# EAGLE board C1316G (EAGLE 6.6.0)
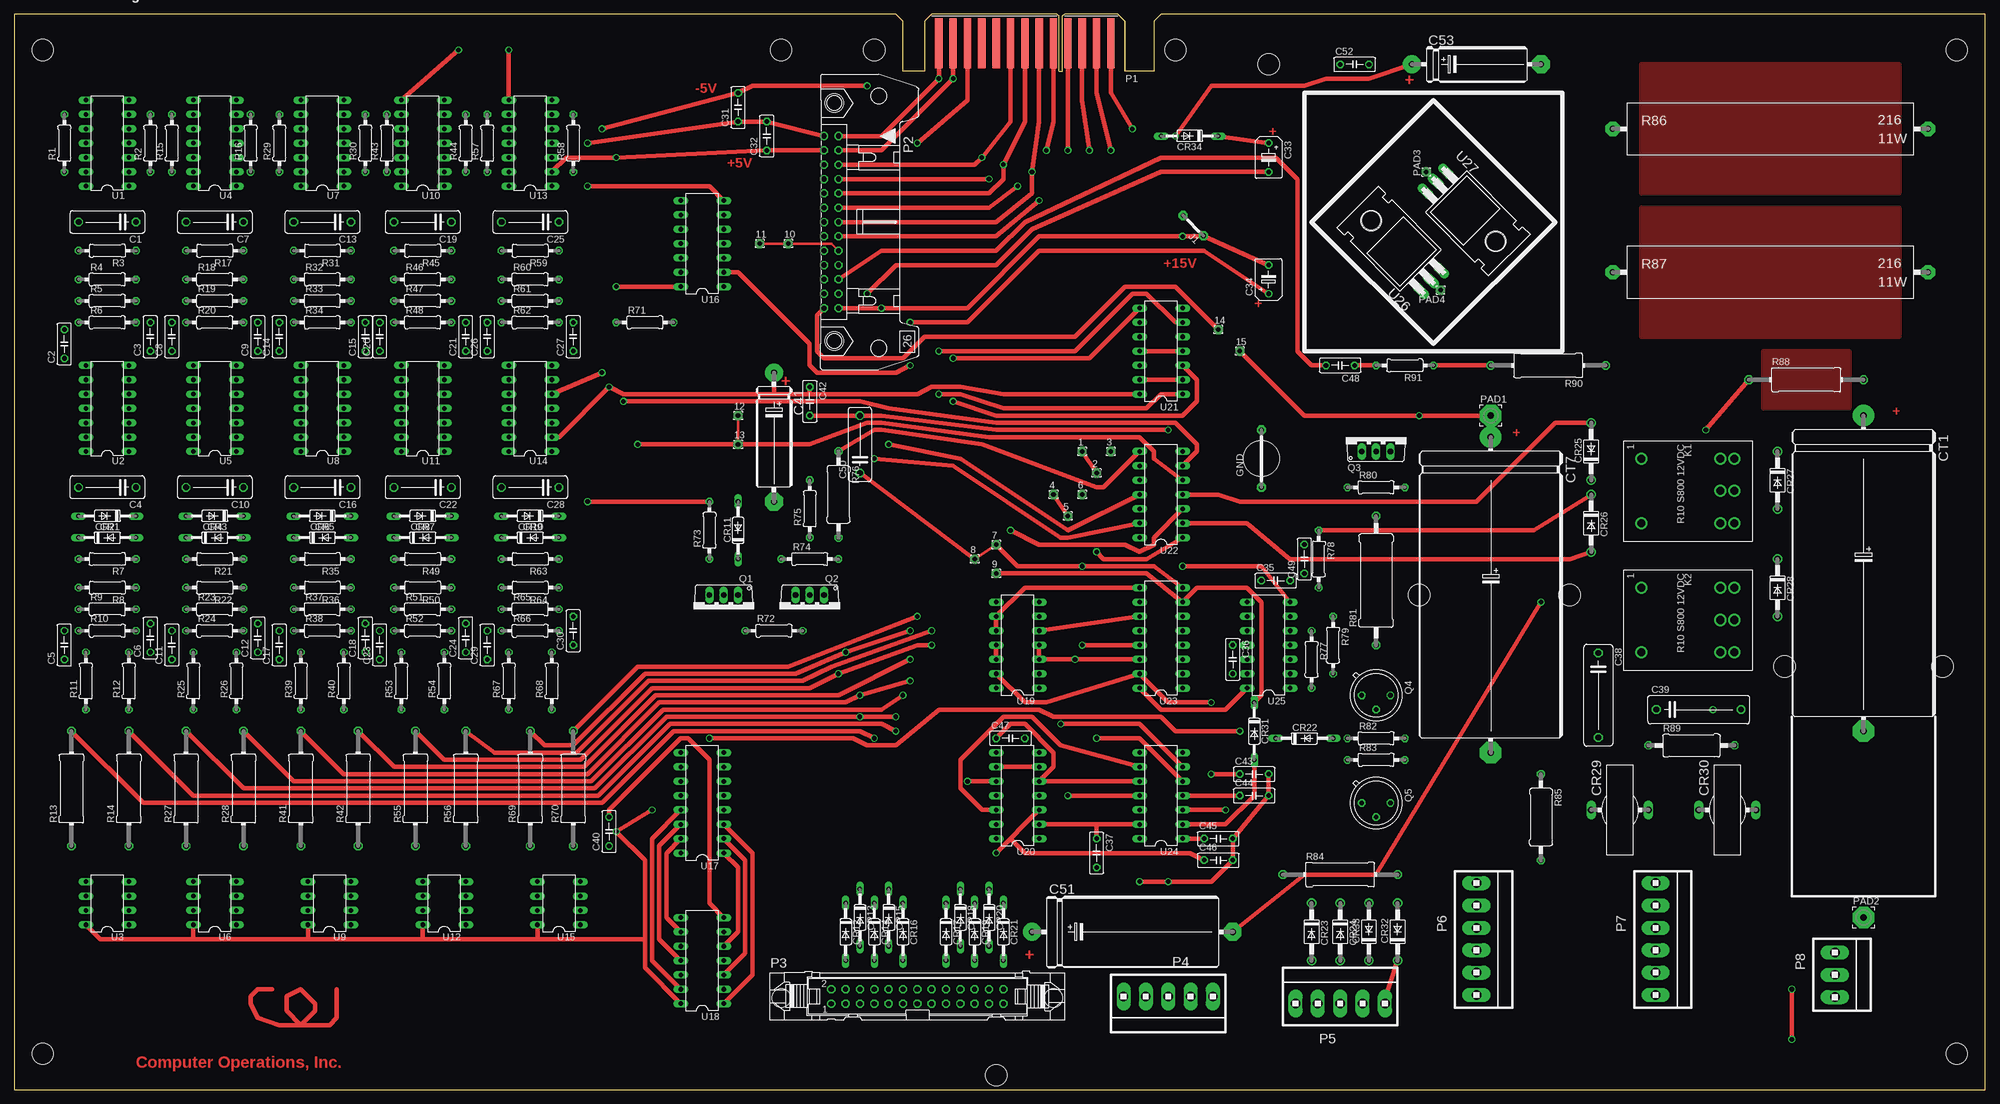
[diagram p2: board, top side]
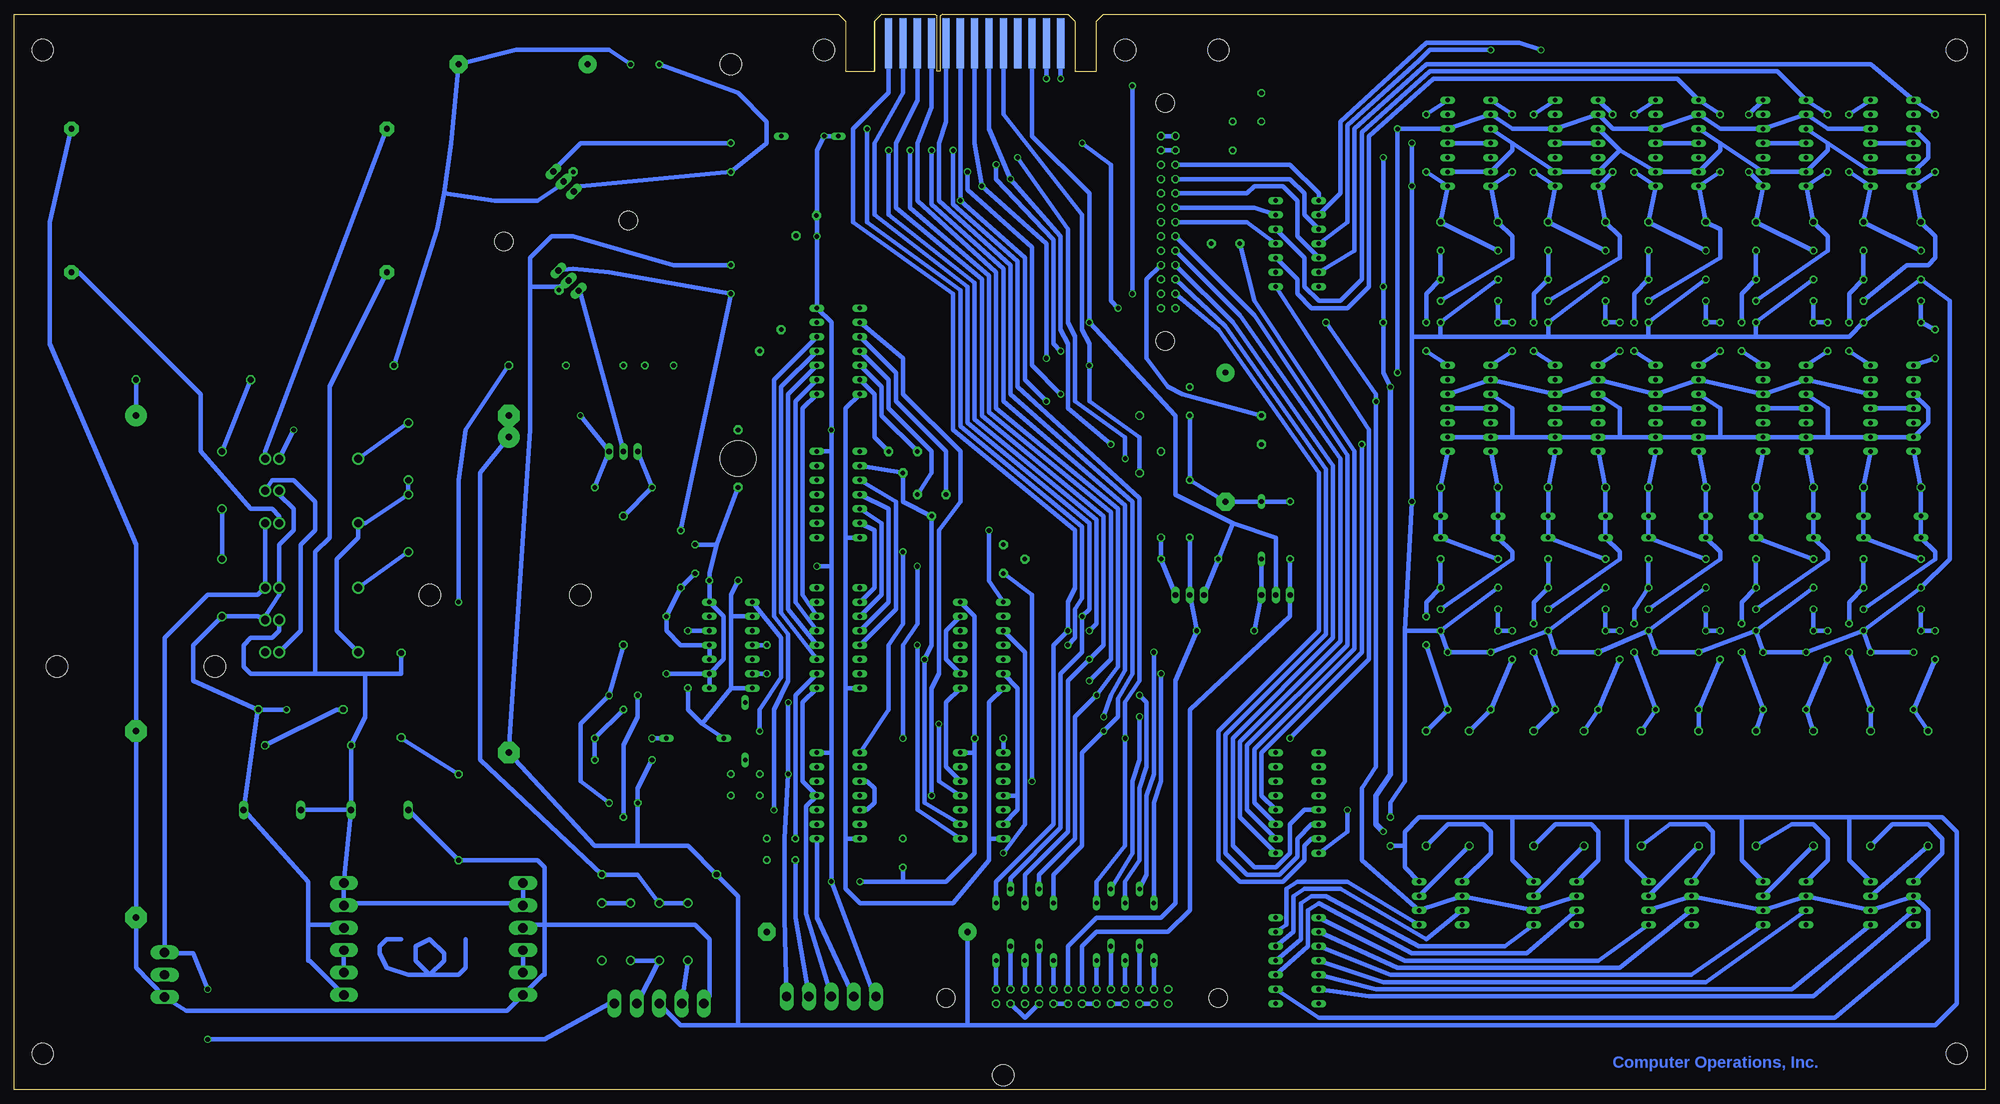
[diagram p3: board, bottom side, seen from below]

Size 349.25 x 190.5 mm. Coordinates in mm from the lower left corner, seen from the top.
Outline: 195.58,190.5 196.85,189.23 196.85,180.34 201.93,180.34 201.93,189.23 203.2,190.5 349.25,190.5 349.25,0 0,0 0,190.5 156.21,190.5 157.48,189.23 157.48,180.34 161.29,180.34 161.29,189.23 162.56,190.5
Copper layers (1+16): Top 0.035mm / dielectric 1.5mm / Bottom 0.035mm
Design rules "16mils": minimum track width 16mil, minimum drill 32mil, track to track 15mil, track to pad 10mil, pad to pad 10mil, via to via 10mil, smd to smd 10mil, copper to edge 9mil, drill to drill 10mil, minimum pad ring 10mil, minimum via ring 8mil, stop-mask expansion 0mil, vias tented up to drill 0mil, thermal gap 10mil
Holes 3.81 mm at 5.08,184.15 5.08,6.35 344.17,6.35 344.17,184.15 135.89,184.15 173.99,2.54 152.4,184.15 205.74,184.15 222.25,181.61 248.92,87.63 275.59,87.63 313.69,74.93 341.63,74.93
Holes 6.35 mm at 220.98,111.76

## Footprints (pad centres in the part's own frame; a part is rotated, then mirrored left to right if it is on the bottom)
1,6/0,8 = drill 0.813 pad 1.6 octagon: 1 0,0
C102-043X133 = drill 1.016 octagon: 1 -5.08,0; 2 5.08,0
C050-025X075 = drill 0.813 octagon: 1 -2.54,0; 2 2.54,0
B45181B = drill 0.813: + -2.54,0 | drill 0.813 octagon: - 2.54,0
C150-054X183 = drill 1.016 octagon: 1 -7.493,0; 2 7.493,0
E22-6 = drill 1.016 pad 3.15: + -11.43,0 | drill 1.016 pad 3.15 octagon: - 11.43,0
E35-12 = drill 1.118 pad 3.15: + -17.78,0 | drill 1.118 pad 3.15 octagon: - 17.78,0
DO35-10 = drill 0.813 long: A 5.08,0; C -5.08,0
DO41-10 = drill 1.118: A 5.08,0; C -5.08,0
N644B = drill 1.118 long: 1 -5.08,0; 2 5.08,0
E55-25 = drill 1.118 pad 3.81: + -27.94,0 | drill 1.118 pad 3.81 octagon: - 27.94,0
10 = drill 0.813 pad 1.6 octagon: 1 -5.08,0; 2 5.08,0
05 = drill 0.813 pad 1.6 octagon: 1 -2.54,0; 2 2.54,0
R10 = drill 1.422: 1 -5.08,-6.35; 4 6.35,-6.35; 5 -5.08,7.62; 6 0.635,10.16; 7 -5.08,10.16; 8 6.35,7.62; 9 0.635,7.62; 10 6.35,10.16
EDGE13X2 = smd 1.27 x 8.89: A1 -15.24,3.873; A2 -12.7,3.873; A3 -10.16,3.873; A4 -7.62,3.873; A5 -5.08,3.873; A6 -2.54,3.873; A7 0,3.873; A8 2.54,3.873; A9 5.08,3.873; A10 7.62,3.873; A11 10.16,3.873; A12 12.7,3.873; A13 15.24,3.873 | smd 1.27 x 8.89 bottom: B1 -15.24,3.873; B2 -12.7,3.873; B3 -10.16,3.873; B4 -7.62,3.873; B5 -5.08,3.873; B6 -2.54,3.873; B7 0,3.873; B8 2.54,3.873; B9 5.08,3.873; B10 7.62,3.873; B11 10.16,3.873; B12 12.7,3.873; B13 15.24,3.873
26H = drill 0.914: 1 -15.24,-1.27 | drill 0.914 octagon: 2 -15.24,1.27; 3 -12.7,-1.27; 4 -12.7,1.27; 5 -10.16,-1.27; 6 -10.16,1.27; 7 -7.62,-1.27; 8 -7.62,1.27; 9 -5.08,-1.27; 10 -5.08,1.27; 11 -2.54,-1.27; 12 -2.54,1.27; 13 0,-1.27; 14 0,1.27; 15 2.54,-1.27; 16 2.54,1.27; 17 5.08,-1.27; 18 5.08,1.27; 19 7.62,-1.27; 20 7.62,1.27; 21 10.16,-1.27; 22 10.16,1.27; 23 12.7,-1.27; 24 12.7,1.27; 25 15.24,-1.27; 26 15.24,1.27 | hole 3.302: -21.082,0.533; 21.082,0.533
26V = drill 0.914: 1 -15.24,-1.27 | drill 0.914 octagon: 2 -15.24,1.27; 3 -12.7,-1.27; 4 -12.7,1.27; 5 -10.16,-1.27; 6 -10.16,1.27; 7 -7.62,-1.27; 8 -7.62,1.27; 9 -5.08,-1.27; 10 -5.08,1.27; 11 -2.54,-1.27; 12 -2.54,1.27; 13 0,-1.27; 14 0,1.27; 15 2.54,-1.27; 16 2.54,1.27; 17 5.08,-1.27; 18 5.08,1.27; 19 7.62,-1.27; 20 7.62,1.27; 21 10.16,-1.27; 22 10.16,1.27; 23 12.7,-1.27; 24 12.7,1.27; 25 15.24,-1.27; 26 15.24,1.27 | hole 3.302: 24.13,-0.254; -24.13,-0.254
1X5MTA = drill 1.676 long: 1 7.925,0; 2 3.962,0; 3 0,0; 4 -3.962,0; 5 -7.925,0
1X6MTA = drill 1.676 long: 1 9.906,0; 2 5.944,0; 3 1.981,0; 4 -1.981,0; 5 -5.944,0; 6 -9.906,0
1X3MTA = drill 1.676 long: 1 3.937,0; 2 -0.025,0; 3 -3.988,0
3,81/1,1 = drill 1.118 pad 3.81 octagon: 1 0,0
TO220AV = drill 1.016 long: B -2.54,-2.54; C 0,-2.54; E 2.54,-2.54
TO5 = drill 0.813 octagon: 1 0,-2.54; 2 2.54,0; 3 0,2.54
0207/10 = drill 0.813 octagon: 1 -5.08,0; 2 5.08,0
0414/20 = drill 1.016 octagon: 1 -10.16,0; 2 10.16,0
0411/15 = drill 0.914 octagon: 1 -7.62,0; 2 7.62,0
0617/22 = drill 1.016 octagon: 1 -11.43,0; 2 11.43,0
KH216-8 = drill 1.016 pad 2.54 octagon: 1 -27.94,0; 2 27.94,0
DIL14 = drill 0.813 long: 1 -7.62,-3.81; 2 -5.08,-3.81; 3 -2.54,-3.81; 4 0,-3.81; 5 2.54,-3.81; 6 5.08,-3.81; 7 7.62,-3.81; 8 7.62,3.81; 9 5.08,3.81; 10 2.54,3.81; 11 0,3.81; 12 -2.54,3.81; 13 -5.08,3.81; 14 -7.62,3.81
DIL08 = drill 0.813 long: 1 -3.81,-3.81; 2 -1.27,-3.81; 3 1.27,-3.81; 4 3.81,-3.81; 5 3.81,3.81; 6 1.27,3.81; 7 -1.27,3.81; 8 -3.81,3.81
DIL16 = drill 0.813 long: 1 -8.89,-3.81; 2 -6.35,-3.81; 3 -3.81,-3.81; 4 -1.27,-3.81; 5 1.27,-3.81; 6 3.81,-3.81; 7 6.35,-3.81; 8 8.89,-3.81; 9 8.89,3.81; 10 6.35,3.81; 11 3.81,3.81; 12 1.27,3.81; 13 -1.27,3.81; 14 -3.81,3.81; 15 -6.35,3.81; 16 -8.89,3.81
TO220H = drill 1.118 long: 1 -2.54,-10.16; 2 0,-10.16; 3 2.54,-10.16 | hole 3.302: 0,4.826

## Placement (x,y rotation side)
1  [1,6/0,8]  189.23,113.03 0 top
2  [1,6/0,8]  191.77,109.22 0 top
3  [1,6/0,8]  194.31,113.03 0 top
4  [1,6/0,8]  184.15,105.41 0 top
5  [1,6/0,8]  186.69,101.6 0 top
6  [1,6/0,8]  189.23,105.41 0 top
7  [1,6/0,8]  173.99,96.52 0 top
8  [1,6/0,8]  170.18,93.98 0 top
9  [1,6/0,8]  173.99,91.44 0 top
10  [1,6/0,8]  137.16,149.86 0 top
11  [1,6/0,8]  132.08,149.86 0 top
12  [1,6/0,8]  128.27,119.38 0 top
13  [1,6/0,8]  128.27,114.3 0 top
14  [1,6/0,8]  213.36,134.62 0 top
15  [1,6/0,8]  217.17,130.81 0 top
C1  [C102-043X133]  16.51,153.67 180 top
C2  [C050-025X075]  8.89,132.08 90 top
C3  [C050-025X075]  24.13,133.35 90 top
C4  [C102-043X133]  16.51,106.68 180 top
C5  [C050-025X075]  8.89,78.74 90 top
C6  [C050-025X075]  24.13,80.01 90 top
C7  [C102-043X133]  35.56,153.67 180 top
C8  [C050-025X075]  27.94,133.35 90 top
C9  [C050-025X075]  43.18,133.35 90 top
C10  [C102-043X133]  35.56,106.68 180 top
C11  [C050-025X075]  27.94,78.74 90 top
C12  [C050-025X075]  43.18,80.01 90 top
C13  [C102-043X133]  54.61,153.67 180 top
C14  [C050-025X075]  46.99,133.35 90 top
C15  [C050-025X075]  62.23,133.35 90 top
C16  [C102-043X133]  54.61,106.68 180 top
C17  [C050-025X075]  46.99,78.74 90 top
C18  [C050-025X075]  62.23,80.01 90 top
C19  [C102-043X133]  72.39,153.67 180 top
C20  [C050-025X075]  64.77,133.35 90 top
C21  [C050-025X075]  80.01,133.35 90 top
C22  [C102-043X133]  72.39,106.68 180 top
C23  [C050-025X075]  64.77,78.74 90 top
C24  [C050-025X075]  80.01,80.01 90 top
C25  [C102-043X133]  91.44,153.67 180 top
C26  [C050-025X075]  83.82,133.35 90 top
C27  [C050-025X075]  99.06,133.35 90 top
C28  [C102-043X133]  91.44,106.68 180 top
C29  [C050-025X075]  83.82,78.74 90 top
C30  [C050-025X075]  99.06,81.28 90 top
C31  [C050-025X075]  128.27,173.99 90 top
C32  [C050-025X075]  133.35,168.91 90 top
C33  [B45181B]  222.25,165.1 270 top
C34  [B45181B]  222.25,143.51 90 top
C35  [C050-025X075]  223.52,90.17 0 top
C36  [C050-025X075]  215.9,76.2 270 top
C37  [C050-025X075]  191.77,41.91 270 top
C38  [C150-054X183]  280.67,69.85 270 top
C39  [C150-054X183]  298.45,67.31 0 top
C40  [C050-025X075]  105.41,45.72 90 top
C41  [E22-6]  134.62,115.57 270 top
C42  [C050-025X075]  140.97,121.92 270 top
C43  470pF  [C050-025X075]  219.71,55.88 0 top
C44  470pF  [C050-025X075]  219.71,52.07 0 top
C45  470pF  [C050-025X075]  213.36,44.45 0 top
C46  470pF  [C050-025X075]  213.36,40.64 0 top
C47  [C050-025X075]  176.53,62.23 0 top
C48  [C050-025X075]  234.95,128.27 180 top
C49  [C050-025X075]  228.6,93.98 90 top
C50  [C102-043X133]  149.86,114.3 90 top
C51  250uF 50V  [E35-12]  198.12,27.94 0 top
C52  [C050-025X075]  237.49,181.61 0 top
C53  [E22-6]  259.08,181.61 0 top
CR1  1N4148  [DO35-10]  16.51,101.6 180 top
CR2  1N4148  [DO35-10]  16.51,97.79 0 top
CR3  1N4148  [DO35-10]  35.56,101.6 180 top
CR4  1N4148  [DO35-10]  35.56,97.79 0 top
CR5  1N4148  [DO35-10]  54.61,101.6 180 top
CR6  1N4148  [DO35-10]  54.61,97.79 0 top
CR7  1N4148  [DO35-10]  72.39,101.6 180 top
CR8  1N4148  [DO35-10]  72.39,97.79 0 top
CR9  1N4148  [DO35-10]  91.44,101.6 180 top
CR10  1N4148  [DO35-10]  91.44,97.79 0 top
CR11  1N4148  [DO35-10]  128.27,99.06 90 top
CR12  1N4148  [DO35-10]  147.32,27.94 270 top
CR13  1N4148  [DO35-10]  149.86,30.48 270 top
CR14  1N4148  [DO35-10]  152.4,27.94 270 top
CR15  1N4148  [DO35-10]  154.94,30.48 270 top
CR16  1N4148  [DO35-10]  157.48,27.94 270 top
CR17  1N4148  [DO35-10]  165.1,27.94 270 top
CR18  1N4148  [DO35-10]  167.64,30.48 270 top
CR19  1N4148  [DO35-10]  170.18,27.94 270 top
CR20  1N4148  [DO35-10]  172.72,30.48 270 top
CR21  1N4148  [DO35-10]  175.26,27.94 270 top
CR22  1N4148  [DO35-10]  228.6,62.23 0 top
CR23  1N4004  [DO41-10]  229.87,27.94 270 top
CR24  1N4004  [DO41-10]  234.95,27.94 270 top
CR25  1N4004  [DO41-10]  279.4,113.03 90 top
CR26  1N4004  [DO41-10]  279.4,100.33 270 top
CR27  1N4004  [DO41-10]  312.42,107.95 270 top
CR28  1N4004  [DO41-10]  312.42,88.9 270 top
CR29  7J5E5  [N644B]  284.48,49.53 0 top
CR30  7J5E5  [N644B]  303.53,49.53 0 top
CR31  1N4148  [DO35-10]  219.71,63.5 270 top
CR32  1N4004  [DO41-10]  245.11,27.94 90 top
CR33  1N4004  [DO41-10]  240.03,27.94 90 top
CR34  1N4148  [DO35-10]  208.28,168.91 180 top
CT1  225uF  [E55-25]  327.66,91.44 270 top
CT7  100uF  [E55-25]  261.62,87.63 270 top
GND  J10MM  [10]  220.98,111.76 90 top
J1  J5MM  [05]  208.91,153.03 135 top
K1  R10 S800 12VDC  [R10]  294.64,106.68 270 top
K2  R10 S800 12VDC  [R10]  294.64,83.82 270 top
P1  EDGE13X2  [EDGE13X2]  179.07,189.23 180 top
P2  [26H]  144.78,153.67 270 top
P3  [26V]  160.02,16.51 0 top
P4  [1X5MTA]  204.47,16.51 180 top
P5  [1X5MTA]  234.95,15.24 0 top
P6  [1X6MTA]  259.08,26.67 270 top
P7  [1X6MTA]  290.83,26.67 270 top
P8  [1X3MTA]  322.58,20.32 270 top
PAD1  [3,81/1,1]  261.62,119.38 0 top
PAD2  [3,81/1,1]  327.66,30.48 0 top
PAD3  [1,6/0,8]  250.19,162.56 90 top
PAD4  [1,6/0,8]  252.73,141.6 180 top
Q1  TIP31A  [TO220AV]  125.73,85.09 180 top
Q2  TIP32  [TO220AV]  140.97,85.09 180 top
Q3  TIP32  [TO220AV]  241.3,115.57 0 top
Q4  2N2222  [TO5]  241.3,69.85 270 top
Q5  2N2222  [TO5]  241.3,50.8 270 top
R1  220  [0207/10]  8.89,167.64 90 top
R2  220  [0207/10]  24.13,167.64 90 top
R3  470  [0207/10]  16.51,148.59 180 top
R4  1000  [0207/10]  16.51,143.51 0 top
R5  470  [0207/10]  16.51,139.7 0 top
R6  1000  [0207/10]  16.51,135.89 0 top
R7  1000  [0207/10]  16.51,93.98 180 top
R8  470  [0207/10]  16.51,88.9 180 top
R9  1000  [0207/10]  16.51,85.09 0 top
R10  470  [0207/10]  16.51,81.28 0 top
R11  12K  [0207/10]  12.7,72.39 90 top
R12  12K  [0207/10]  20.32,72.39 90 top
R13  100 5W  [0414/20]  10.16,53.34 90 top
R14  100 5W  [0414/20]  20.32,53.34 90 top
R15  220  [0207/10]  27.94,167.64 90 top
R16  220  [0207/10]  41.91,167.64 90 top
R17  470  [0207/10]  35.56,148.59 180 top
R18  1000  [0207/10]  35.56,143.51 0 top
R19  470  [0207/10]  35.56,139.7 0 top
R20  1000  [0207/10]  35.56,135.89 0 top
R21  1000  [0207/10]  35.56,93.98 180 top
R22  470  [0207/10]  35.56,88.9 180 top
R23  1000  [0207/10]  35.56,85.09 0 top
R24  470  [0207/10]  35.56,81.28 0 top
R25  12K  [0207/10]  31.75,72.39 90 top
R26  12K  [0207/10]  39.37,72.39 90 top
R27  100 5W  [0414/20]  30.48,53.34 90 top
R28  100 5W  [0414/20]  40.64,53.34 90 top
R29  220  [0207/10]  46.99,167.64 90 top
R30  220  [0207/10]  62.23,167.64 90 top
R31  470  [0207/10]  54.61,148.59 180 top
R32  1000  [0207/10]  54.61,143.51 0 top
R33  470  [0207/10]  54.61,139.7 0 top
R34  1000  [0207/10]  54.61,135.89 0 top
R35  1000  [0207/10]  54.61,93.98 180 top
R36  470  [0207/10]  54.61,88.9 180 top
R37  1000  [0207/10]  54.61,85.09 0 top
R38  470  [0207/10]  54.61,81.28 0 top
R39  12K  [0207/10]  50.8,72.39 90 top
R40  12K  [0207/10]  58.42,72.39 90 top
R41  100 5W  [0414/20]  50.8,53.34 90 top
R42  100 5W  [0414/20]  60.96,53.34 90 top
R43  220  [0207/10]  66.04,167.64 90 top
R44  220  [0207/10]  80.01,167.64 90 top
R45  470  [0207/10]  72.39,148.59 180 top
R46  1000  [0207/10]  72.39,143.51 0 top
R47  470  [0207/10]  72.39,139.7 0 top
R48  1000  [0207/10]  72.39,135.89 0 top
R49  1000  [0207/10]  72.39,93.98 180 top
R50  470  [0207/10]  72.39,88.9 180 top
R51  1000  [0207/10]  72.39,85.09 0 top
R52  470  [0207/10]  72.39,81.28 0 top
R53  12K  [0207/10]  68.58,72.39 90 top
R54  12K  [0207/10]  76.2,72.39 90 top
R55  100 5W  [0414/20]  71.12,53.34 90 top
R56  100 5W  [0414/20]  80.01,53.34 90 top
R57  220  [0207/10]  83.82,167.64 90 top
R58  220  [0207/10]  99.06,167.64 90 top
R59  470  [0207/10]  91.44,148.59 180 top
R60  1000  [0207/10]  91.44,143.51 0 top
R61  470  [0207/10]  91.44,139.7 0 top
R62  1000  [0207/10]  91.44,135.89 0 top
R63  1000  [0207/10]  91.44,93.98 180 top
R64  470  [0207/10]  91.44,88.9 180 top
R65  1000  [0207/10]  91.44,85.09 0 top
R66  470  [0207/10]  91.44,81.28 0 top
R67  12K  [0207/10]  87.63,72.39 90 top
R68  12K  [0207/10]  95.25,72.39 90 top
R69  100 5W  [0414/20]  91.44,53.34 90 top
R70  100 5W  [0414/20]  99.06,53.34 90 top
R71  1000  [0207/10]  111.76,135.89 0 top
R72  [0207/10]  134.62,81.28 0 top
R73  12K  [0207/10]  123.19,99.06 90 top
R74  180  [0207/10]  140.97,93.98 0 top
R75  12K  [0207/10]  140.97,102.87 90 top
R76  5K 1/2W  [0411/15]  146.05,105.41 270 top
R77  1000  [0207/10]  229.87,76.2 270 top
R78  1000  [0207/10]  231.14,93.98 270 top
R79  220  [0207/10]  233.68,78.74 270 top
R80  [0207/10]  241.3,106.68 0 top
R81  400 3W  [0617/22]  241.3,90.17 90 top
R82  100  [0207/10]  241.3,62.23 0 top
R83  5.7K  [0207/10]  241.3,58.42 0 top
R84  1.5K 3W  [0414/20]  234.95,38.1 0 top
R85  29 1W  [0411/15]  270.51,48.26 270 top
R86  120 5%  [KH216-8]  311.15,170.18 0 top
R87  120 5%  [KH216-8]  311.15,144.78 0 top
R88  180 5W  [0414/20]  317.5,125.73 0 top
R89  29 1W  [0411/15]  297.18,60.96 0 top
R90  100 5W  [0414/20]  271.78,128.27 180 top
R91  [0207/10]  246.38,128.27 180 top
U1  UA733N  [DIL14]  16.51,167.64 90 top
U2  UA733N  [DIL14]  16.51,120.65 90 top
U3  DS75452N  [DIL08]  16.51,33.02 90 top
U4  UA733N  [DIL14]  35.56,167.64 90 top
U5  UA733N  [DIL14]  35.56,120.65 90 top
U6  DS75452N  [DIL08]  35.56,33.02 90 top
U7  UA733N  [DIL14]  54.61,167.64 90 top
U8  UA733N  [DIL14]  54.61,120.65 90 top
U9  DS75452N  [DIL08]  55.88,33.02 90 top
U10  UA733N  [DIL14]  72.39,167.64 90 top
U11  UA733N  [DIL14]  72.39,120.65 90 top
U12  DS75452N  [DIL08]  76.2,33.02 90 top
U13  UA733N  [DIL14]  91.44,167.64 90 top
U14  UA733N  [DIL14]  91.44,120.65 90 top
U15  DS75452N  [DIL08]  96.52,33.02 90 top
U16  7406N  [DIL14]  121.92,149.86 90 top
U17  [DIL16]  121.92,50.8 90 top
U18  7404N  [DIL14]  121.92,22.86 90 top
U19  7410N  [DIL14]  177.8,78.74 90 top
U20  7410N  [DIL14]  177.8,52.07 90 top
U21  7406N  [DIL14]  203.2,130.81 90 top
U22  7406N  [DIL14]  203.2,105.41 90 top
U23  [DIL16]  203.2,80.01 90 top
U24  7408N  [DIL14]  203.2,52.07 90 top
U25  74122N  [DIL14]  222.25,78.74 90 top
U26  7815T  [TO220H]  243.84,150.5 45 top
U27  7905T  [TO220H]  259.08,153.67 225 top

## Tracks (layer width: path | path; a pad name or v marks a point on that pad's centre or on a via)
!DS  (via drill 0.81)
  Top 0.813: U21.8 190.5,129.54 v166.37,129.54 | P2.12 172.72,156.21 v177.8,160.02
  Bottom 0.813: v166.37,129.54 166.37,149.86 v177.8,160.02 179.07,167.64 P1.B7
!IFE  (via drill 0.81)
  Top 0.406: 13.1 12.1
  Top 0.813: v110.49,114.3 13.1 140.97,114.3 151.13,118.11 153.67,118.11 172.72,115.57 199.39,115.57 201.93,113.03 201.93,111.76 U22.5
  Bottom 0.813: v110.49,114.3 110.49,77.47 128.27,59.69 128.27,52.07 U17.4 | 12.1 142.24,123.19 144.78,124.46 148.59,129.54 148.59,143.51 P2.20
!IWE
  Top 0.406: 11.1 10.1 144.78,149.86 P2.18
  Top 0.813: U18.1 130.81,20.32 130.81,41.91 U17.3
  Bottom 0.813: U17.3 129.54,50.8 129.54,60.33 111.76,78.11 111.76,113.03 129.54,139.7 11.1
!WE  (via drill 0.81)
  Top 0.813: P2.10 172.72,158.75 175.26,161.29 v175.26,163.83 179.07,171.45 P1.A7 | v163.83,130.81 187.96,130.81 198.12,140.97 200.66,140.97 205.74,135.89 U21.6
  Bottom 0.813: v175.26,163.83 175.26,161.29 165.1,150.5 165.1,132.08 v163.83,130.81
+15V  (via drill 0.81)
  Top 0.813: C34.+ 210.82,148.59 181.61,148.59 168.91,135.89 v158.75,135.89 | CR26.C 269.24,99.06 R78.1
  Bottom 0.813: R78.1 C34.+ 243.84,144.78 250.19,145.41 U26.3 | CR25.C CR26.C 287.02,100.33 K1.4 288.29,97.79 292.1,93.98 292.1,81.28 K2.4 | 133.35,100.33 143.51,105.41 143.51,119.38 v158.75,135.89 158.75,158.75 168.91,168.91 P1.B11 | 133.35,100.33 R74.1 Q2.E | 133.35,100.33 125.73,97.79 Q1.C
+U
  Top 0.813: 14.1 205.74,142.24 196.85,142.24 187.96,133.35 161.29,133.35 157.48,129.54 143.51,129.54 142.24,130.81 142.24,137.16 P2.25
+UB  (via drill 0.81)
  Top 0.813: PAD1.1 v248.92,119.38 228.6,119.38 15.1
  Bottom 0.813: CR23.C CR24.C 238.76,38.1 R84.2 266.7,58.42 266.7,109.22 CT7.+ PAD1.1 | R80.2 Q3.E v248.92,119.38
-5V  (via drill 0.81)
  Top 0.813: v104.14,127 U14.5 | v104.14,170.18 C31.2 130.81,177.8 v151.13,177.8 | C33.- 203.2,162.56 180.34,152.4 173.99,146.05 156.21,146.05 v151.13,140.97
  Bottom 0.813: U2.5 U5.9 U5.5 U8.9 U8.5 U11.9 U11.5 U14.9 U14.5 | U1.5 27.94,170.18 U4.9 U4.5 46.99,170.18 U7.9 U7.5 66.04,170.18 U10.9 U10.5 83.82,170.18 U13.9 U13.5 v104.14,170.18 v104.14,127 | C52.1 220.98,176.53 215.9,171.45 215.9,167.64 C33.- 248.92,160.02 250.19,158.75 U27.3 | v151.13,177.8 v151.13,140.97
-U
  Top 0.813: P2.22 153.67,148.59 173.99,148.59 179.07,153.67 203.2,165.1 223.52,165.1 227.33,161.29 227.33,130.81 229.87,128.27 C48.2
-UB
  Bottom 0.813: CR33.A CR32.A
FORW  (via drill 0.81)
  Top 0.813: U22.13 186.69,97.79 185.42,97.79 166.37,110.49 v152.4,111.76 | P2.6 170.18,163.83 v171.45,165.1 176.53,171.45 P1.A8
  Bottom 0.813: U23.10 196.85,88.9 196.85,99.06 U22.13 | v171.45,165.1 162.56,152.4 162.56,135.89 161.29,133.35 161.29,121.92 152.4,115.57 v152.4,111.76
GND  (via drill 0.81)
  Top 0.813: v204.47,116.84 173.99,116.84 153.67,119.38 C50.2 C42.2 | R73.2 v101.6,104.14 | C53.+ 240.03,179.07 232.41,179.07 228.6,177.8 212.09,177.8 v205.74,168.91 | P2.1 C32.2 C31.1 v101.6,167.64 | U16.7 123.19,160.02 v101.6,160.02 | v207.01,92.71 220.98,92.71 U25.7 | v199.39,36.83 v204.47,36.83 212.09,36.83 C46.2 C45.2 C44.2 C43.2 | C40.2 105.41,49.53 118.11,62.23 119.38,62.23 123.19,58.42 123.19,33.02 U18.7 | C34.- 210.82,151.13 | 210.82,151.13 J1.1 | 210.82,151.13 v207.01,151.13 181.61,151.13 168.91,138.43 v153.67,138.43 P2.26 | P1.A11 168.91,175.26 v160.02,167.64 | P2.2 153.67,168.91 v163.83,179.07 P1.B13
  Bottom 0.813: U3.4 24.13,40.64 24.13,48.26 | P5.3 231.14,11.43 220.98,11.43 | 220.98,11.43 180.34,11.43 | 180.34,11.43 8.89,11.43 5.08,15.24 5.08,45.72 7.62,48.26 24.13,48.26 | 24.13,48.26 43.18,48.26 | 43.18,48.26 63.5,48.26 | 63.5,48.26 83.82,48.26 | 83.82,48.26 100.33,48.26 102.87,45.72 102.87,43.18 | 102.87,43.18 102.87,39.37 U15.4 | U6.4 43.18,40.64 43.18,48.26 | U9.4 63.5,40.64 63.5,48.26 | U12.4 83.82,40.64 83.82,48.26 | 220.98,11.43 220.98,34.29 R84.1 229.87,43.18 238.76,43.18 | 238.76,43.18 246.38,43.18 CT7.- 257.81,116.84 257.81,142.24 | 257.81,142.24 257.81,147.32 254,151.13 250.19,151.13 232.41,146.05 C34.- | 207.01,154.94 v207.01,151.13 U21.7 204.47,135.89 v204.47,116.84 204.47,113.03 | 207.01,154.94 207.01,166.37 v205.74,168.91 CR34.A | 204.47,59.69 U24.7 | 204.47,59.69 v204.47,36.83 196.85,16.51 P4.1 | 204.47,113.03 U22.7 | 204.47,92.71 204.47,59.69 | 204.47,113.03 204.47,92.71 | 204.47,92.71 v207.01,92.71 | P2.1 P2.2 | R83.1 238.76,53.34 Q5.1 238.76,43.18 | 224.79,96.52 226.06,91.44 C35.2 U25.7 223.52,83.82 223.52,76.2 U25.2 | 224.79,96.52 GND.1 | 179.07,59.69 U20.7 | 179.07,59.69 179.07,41.91 184.15,36.83 191.77,36.83 | v199.39,36.83 191.77,36.83 | U19.7 179.07,83.82 C47.2 179.07,59.69 | R38.2 R40.2 R39.2 R24.2 | R38.2 R36.2 | R11.2 R12.2 R10.2 | R10.2 R8.2 6.35,93.98 6.35,139.7 R4.1 R6.2 24.13,133.35 40.64,133.35 | R24.2 R26.2 R25.2 R10.2 | R24.2 R22.2 | R18.1 R20.2 40.64,133.35 | 101.6,133.35 96.52,133.35 | 96.52,133.35 77.47,133.35 | 77.47,133.35 59.69,133.35 | 59.69,133.35 40.64,133.35 | 101.6,133.35 v101.6,160.02 v101.6,167.64 | 101.6,133.35 v101.6,104.14 102.87,81.28 | R52.2 R54.2 R53.2 R38.2 | R52.2 R50.2
  Bottom 0.813: R66.2 R68.2 R67.2 R52.2 | R66.2 R64.2 | 102.87,81.28 R66.2 | R46.1 R48.2 77.47,133.35 | R32.1 R34.2 59.69,133.35 | 96.52,133.35 R62.2 R60.1 | C40.2 105.41,50.8 102.87,54.61 102.87,81.28 | R73.2 CR11.A C41.- R75.2 C42.2 | 257.81,142.24 252.73,142.24 | 252.73,142.24 PAD4.1 | 252.73,142.24 U26.2 | 224.79,96.52 C49.2 | 102.87,43.18 C40.1 | 191.77,36.83 C37.2 | U25.2 U25.1 | U25.2 R79.2 | 207.01,154.94 J1.2 | 180.34,11.43 C51.+ | v153.67,138.43 154.94,139.7 154.94,163.83 v160.02,167.64 | v163.83,179.07 P1.B13
ID1
  Top 0.813: U18.13 113.03,22.86 113.03,44.45 U17.13
  Bottom 0.813: U3.7 30.48,16.51 109.22,16.51 U18.13 | U17.13 120.65,49.53 123.19,46.99 123.19,41.91 125.73,39.37 129.54,39.37 133.35,43.18 133.35,62.23 115.57,80.01 115.57,110.49 133.35,135.89 P2.19
ID2
  Top 0.813: U18.11 114.3,26.67 114.3,43.18 U17.14
  Bottom 0.813: U6.7 49.53,19.05 106.68,19.05 U18.11 | U17.14 119.38,46.99 121.92,44.45 121.92,41.27 125.09,38.1 130.81,38.1 134.62,41.91 134.62,62.87 116.84,80.64 116.84,109.86 134.62,135.25 P2.21
ID3
  Top 0.813: U18.9 115.57,30.48 115.57,41.91 U17.15
  Bottom 0.813: U9.7 64.77,21.59 104.14,21.59 U18.9 | U17.15 119.38,44.45 120.65,43.18 120.65,40.64 124.46,36.83 132.08,36.83 135.89,40.64 135.89,63.5 118.11,81.28 118.11,109.22 135.89,134.62 P2.23
IMARK
  Top 0.813: U18.5 128.27,27.94 128.27,39.37 U17.1
  Bottom 0.813: U18.5 122.56,27.94 122.56,34.29 120.65,35.56 114.3,35.56 99.06,26.67 U15.7 | U17.1 132.08,48.26 132.08,61.59 114.3,79.38 114.3,111.76 132.08,137.16 P2.17
ITIMING
  Top 0.813: U18.3 129.54,24.13 129.54,40.64 U17.2
  Bottom 0.813: U18.3 120.02,25.4 120.02,31.75 118.11,33.02 101.6,24.13 81.28,24.13 U12.7 | U17.2 130.81,49.53 130.81,60.96 113.03,78.74 113.03,112.39 129.54,137.16 P2.15
K1
  Top 0.813: CR25.A 273.05,118.11 259.08,104.14 217.17,104.14 213.36,105.41 U22.4
  Bottom 0.813: CR25.A K1.1
K2
  Top 0.813: U22.2 218.44,100.33 226.06,93.98 227.33,93.98 228.6,93.98 275.59,93.98 CR26.A
  Bottom 0.813: CR26.A K2.1
LOAD(RED)  (via drill 0.81)
  Top 0.813: U23.9 179.07,88.9 U19.9 U19.10 | U20.3 v173.99,41.91 176.53,44.45 179.07,41.91 208.28,41.91 C46.1
  Bottom 0.813: P4.4 210.82,30.48 C46.1 | U19.10 170.18,77.47 170.18,46.99 v173.99,41.91
N$2
  Bottom 0.813: R33.2 46.99,147.32 46.99,152.4 C13.2 U7.14 R29.1
N$3
  Bottom 0.813: R29.2 U7.8 54.61,179.07 97.79,179.07 109.22,168.91 109.22,163.83 109.22,142.24 113.03,138.43 119.38,138.43 121.92,140.97 121.92,143.51 U16.3
N$4
  Bottom 0.813: R31.2 C13.1 U7.1 R30.1
N$5
  Bottom 0.813: U7.7 R30.2
N$6
  Bottom 0.813: C15.2 62.23,140.97 R32.2 R31.1
N$7
  Bottom 0.813: R33.1 R34.1 C14.2
N$8
  Bottom 0.813: R35.2 CR6.A CR5.C C16.1 U8.1
N$9
  Bottom 0.813: C17.2 R38.1 R37.1
N$10
  Bottom 0.813: R37.2 46.99,93.98 46.99,95.25 CR6.C CR5.A C16.2 U8.14
N$11
  Bottom 0.813: U9.3 R41.1
N$12
  Bottom 0.813: R5.2 13.97,146.05 10.16,146.05 8.89,147.32 8.89,151.13 C1.2 U1.14 R1.1
N$13
  Bottom 0.813: R1.2 U1.8 20.32,181.61 99.06,181.61 111.76,170.18 111.76,165.1 111.76,148.59 U16.13
N$14
  Bottom 0.813: R3.2 C1.1 U1.1 R2.1
N$15
  Bottom 0.813: U1.7 R2.2
N$16
  Bottom 0.813: R7.1 R8.1 24.13,86.36 C6.2
N$17
  Bottom 0.813: C3.2 24.13,140.97 R4.2 R3.1
N$18  (via drill 0.81)
  Top 0.813: v186.69,52.07 U24.11
  Bottom 0.813: v186.69,52.07 186.69,71.12 185.42,73.66 185.42,99.06 181.61,104.14 181.61,113.03 191.77,123.19 191.77,129.54 U21.9
N$19  (via drill 0.81)
  Top 0.813: R14.2 31.75,52.07 103.5,52.07 116.2,64.77 153.67,64.77 v156.21,63.5
  Bottom 0.813: R14.2 R12.1 C6.1 | P1.B5 184.15,171.45 185.42,167.64 185.42,157.48 172.72,146.05 172.72,123.19 151.13,104.14 151.13,73.66 153.67,69.22 153.67,66.04 v156.21,63.5 160.02,59.69 160.02,43.18 165.1,38.1 CR17.C
N$20
  Bottom 0.813: R5.1 R6.1 C2.2
N$21  (via drill 0.81)
  Top 0.813: R13.2 22.86,50.8 104.14,50.8 116.84,63.5 149.86,63.5 v152.4,62.23 | P1.A5 184.15,171.45 v182.88,166.37
  Bottom 0.813: C5.1 R11.1 R13.2 | CR16.C 157.48,36.83 152.4,43.18 v152.4,62.23 152.4,68.58 149.86,72.39 149.86,104.78 171.45,124.46 171.45,146.69 182.88,156.84 v182.88,166.37
N$22  (via drill 0.81)
  Top 0.813: v314.96,8.89 v314.96,17.78 | P5.1 242.57,15.24 CR32.C
  Bottom 0.813: v314.96,8.89 255.27,8.89 243.84,15.24 P5.1 | 322.58,24.13 322.58,80.01 314.96,87.63 306.07,87.63 K2.7 K1.10 | 322.58,24.13 317.5,24.13 v314.96,17.78 | 322.58,24.13 P8.3
N$23
  Bottom 0.813: 255.27,29.21 228.6,29.21 226.06,26.67 226.06,16.51 P5.5 | 255.27,29.21 255.27,20.32 255.52,20.32 P6.1 261.87,13.97 318.77,13.97 P8.1 327.66,21.59 PAD2.1 CT1.- 327.66,96.52 342.9,132.08 342.9,153.67 R86.2 | 255.27,29.21 255.27,39.37 256.54,40.64 R85.2 CR29.1 | P6.4 258.52,29.21 255.27,29.21
N$24
  Bottom 0.813: R7.2 CR2.A CR1.C C4.1 U2.1
N$25
  Bottom 0.813: P5.4 CR23.A
N$26
  Bottom 0.813: R19.2 27.94,148.59 27.94,151.13 C7.2 U4.14 R15.1
N$27
  Bottom 0.813: P5.2 CR24.A CR33.C
N$28
  Bottom 0.813: R9.1 R10.1 C5.2
N$29
  Bottom 0.813: R9.2 8.89,93.98 8.89,95.25 CR2.C CR1.A C4.2 U2.14
N$30
  Bottom 0.813: R15.2 U4.8 36.83,180.34 98.42,180.34 110.49,169.54 110.49,165.1 110.49,143.51 114.3,139.7 118.11,139.7 120.65,142.24 120.65,147.32 U16.5
N$31
  Bottom 0.813: R17.2 C7.1 U4.1 R16.1
N$33
  Bottom 0.813: U4.7 R16.2
N$34
  Bottom 0.813: R76.2 R74.2 Q2.B
N$35
  Bottom 0.813: C9.2 43.18,140.97 R18.2 R17.1
N$36
  Bottom 0.813: R13.1 U3.3
N$38
  Bottom 0.813: R14.1 16.51,46.99 10.16,46.99 7.62,44.45 7.62,41.91 U3.5
N$40
  Bottom 0.813: R19.1 R20.1 C8.2
N$41
  Bottom 0.813: R21.2 CR4.A CR3.C C10.1 U5.1
N$42
  Bottom 0.813: C11.2 R24.1 R23.1
N$43
  Bottom 0.813: R23.2 27.94,93.98 27.94,95.25 CR4.C CR3.A C10.2 U5.14
N$44
  Bottom 0.813: U6.3 R27.1
N$45
  Bottom 0.813: U1.11 U1.4
N$46
  Bottom 0.813: U6.5 27.94,40.64 27.94,44.45 30.48,46.99 34.29,46.99 R28.1
N$47
  Bottom 0.813: U4.11 U4.4
N$48
  Bottom 0.813: U5.11 U5.4
N$49
  Bottom 0.813: U5.7 C9.1
N$50
  Bottom 0.813: U5.8 C8.1
N$51
  Bottom 0.813: U18.2 118.11,12.7 26.67,12.7 10.16,26.67 10.16,31.75 U3.6 U3.2 U6.6 U6.2 U9.6 U9.2
N$52
  Bottom 0.813: U6.1 52.07,20.32 105.41,20.32 U18.10
N$53
  Bottom 0.813: U2.11 U2.4
N$55
  Bottom 0.813: C12.2 43.18,86.36 R22.1 R21.1
N$56  (via drill 0.81)
  Top 0.813: R27.2 40.64,53.34 102.87,53.34 115.57,66.04 v149.86,66.04 v156.21,66.04 | v186.69,166.37 P1.A4
  Bottom 0.813: R27.2 R25.1 C11.1 | CR15.C 151.13,41.91 151.13,54.61 149.86,58.42 v149.86,66.04 | v156.21,66.04 154.94,69.85 152.4,74.3 152.4,103.5 173.99,121.92 173.99,145.41 186.69,156.84 v186.69,166.37
N$57  (via drill 0.81)
  Top 0.813: R28.2 49.53,54.61 102.23,54.61 114.94,67.31 153.67,67.31 v157.48,69.85
  Bottom 0.813: R28.2 R26.1 C12.1 | P1.B4 186.69,173.99 189.23,167.64 189.23,157.48 175.26,144.78 175.26,120.65 153.67,102.87 153.67,74.93 v157.48,69.85 161.29,66.04 161.29,44.45 167.64,38.1 CR18.C
N$58
  Bottom 0.813: U2.7 C3.1
N$59
  Bottom 0.813: C2.1 U2.8
N$60  (via drill 0.81)
  Top 0.813: P1.A1 194.31,176.53 v198.12,170.18 | R55.2 76.2,58.42 100.33,58.42 113.03,71.12 140.97,71.12 v146.05,73.66 160.02,78.74 v162.56,78.74
  Bottom 0.813: v198.12,170.18 198.12,153.67 181.61,141.6 181.61,117.47 160.02,99.69 160.02,87 161.29,85.09 161.29,80.01 v162.56,78.74 | CR12.C 147.32,50.8 146.05,54.61 v146.05,73.66 | R55.2 R53.1 C23.1
N$61
  Bottom 0.813: U3.1 34.29,17.78 107.95,17.78 U18.12
N$62
  Bottom 0.813: P3.3 P3.5
N$63
  Bottom 0.813: P3.4 CR12.A
N$64
  Bottom 0.813: U9.5 48.26,41.91 48.26,45.72 49.53,46.99 55.88,46.99 R42.1
N$66
  Bottom 0.813: P3.6 CR13.A
N$67  (via drill 0.81)
  Top 0.813: v78.74,184.15 U10.8
  Bottom 0.813: v78.74,184.15 82.55,185.42 99.06,185.42 114.3,171.45 114.3,168.91 114.3,158.75 U16.9 | U10.8 R43.2
N$68  (via drill 0.81)
  Top 0.813: U13.8 v87.63,184.15
  Bottom 0.813: R57.2 U13.8 | v87.63,184.15 98.42,184.15 100.33,182.25 113.03,170.81 113.03,165.1 113.03,153.67 U16.11
N$69
  Bottom 0.813: U7.11 U7.4
N$70
  Bottom 0.813: U8.11 U8.4
N$71
  Bottom 0.813: U18.4 121.28,26.67 121.28,33.02 119.38,34.29 116.84,34.29 100.33,25.4 85.09,25.4 U12.1
N$72
  Bottom 0.813: U18.6 123.83,29.21 123.83,35.56 121.92,36.83 113.03,36.83 U15.1
N$73
  Bottom 0.813: U9.1 68.58,22.86 102.87,22.86 U18.8
N$74
  Bottom 0.813: P3.7 P3.9
N$75
  Bottom 0.813: P3.8 CR14.A
N$76
  Bottom 0.813: Q5.3 248.92,54.61 248.92,64.77 Q4.3 R81.1
N$77
  Bottom 0.813: P3.10 CR15.A
N$78  (via drill 0.81)
  Top 0.406: 7.1 8.1
  Top 0.813: U23.8 201.93,92.71 v189.23,92.71 177.8,92.71 7.1 | 8.1 C50.1 | U24.5 199.39,62.23 v191.77,62.23 | U16.2 128.27,144.78 140.97,132.08 140.97,128.27 142.24,127 156.21,127 v158.75,128.27
  Bottom 0.813: C50.1 149.86,115.57 158.75,121.92 v158.75,128.27 158.75,132.08 160.02,134.62 160.02,154.94 173.99,172.72 P1.B9 | v191.77,62.23 191.77,78.74 189.23,82.55 v189.23,92.71
N$79
  Bottom 0.813: P3.11 P3.13
N$80
  Bottom 0.813: P3.12 CR16.A
N$81
  Bottom 0.813: R72.1 Q1.B CR11.C
N$82
  Bottom 0.813: R73.1 Q1.E 123.19,83.82 140.97,67.31 140.97,31.75 144.78,27.94 157.48,27.94 160.02,25.4 P3.14
N$83
  Bottom 0.813: U8.7 C15.1
N$84
  Bottom 0.813: C14.1 U8.8
N$85
  Top 0.813: U22.8 193.04,106.68 191.77,106.68 171.45,114.3 153.67,116.84 152.4,116.84 R76.1
N$87
  Top 0.813: U21.4 U21.11
  Bottom 0.813: U23.3 213.36,84.45 213.36,124.46 U21.4 | 6.1 186.69,109.22 186.69,113.03 194.31,120.65 194.31,125.73 U21.11
N$88
  Bottom 0.813: C18.2 62.23,85.09 R36.1 R35.1
N$89  (via drill 0.81)
  Top 0.813: R41.2 58.42,55.88 101.6,55.88 114.3,68.58 147.32,68.58 v149.86,69.85 v158.75,72.39 | P1.A3 189.23,175.26 v190.5,166.37
  Bottom 0.813: R41.2 R39.1 C17.1 | v190.5,166.37 190.5,156.21 176.53,144.15 176.53,120.02 154.94,102.23 154.94,76.2 v158.75,72.39 | CR14.C 152.4,36.83 149.86,40.64 149.86,53.34 148.59,57.15 148.59,68.58 v149.86,69.85
N$90  (via drill 0.81)
  Top 0.813: R42.2 67.31,57.15 100.97,57.15 113.67,69.85 146.05,69.85 v158.75,76.2
  Bottom 0.813: R42.2 R40.1 C18.1 | P1.B3 189.23,175.26 193.04,167.64 193.04,156.21 177.8,143.51 177.8,119.38 156.21,101.6 156.21,78.74 v158.75,76.2 162.56,72.39 162.56,45.72 170.18,38.1 CR19.C
N$91
  Bottom 0.813: R89.2 292.1,67.31 C39.1
N$92
  Bottom 0.813: R47.2 64.77,147.32 64.77,151.13 C19.2 U10.14 R43.1
N$93
  Bottom 0.813: P3.15 P3.17
N$94
  Bottom 0.813: R45.2 C19.1 U10.1 R44.1
N$95
  Bottom 0.813: U10.7 R44.2
N$96
  Bottom 0.813: C21.2 80.01,140.97 R46.2 R45.1
N$97
  Bottom 0.813: C20.2 R48.1 R47.1
N$98
  Bottom 0.813: R49.2 CR8.A CR7.C C22.1 U11.1
N$99
  Bottom 0.813: C23.2 R52.1 R51.1
N$100
  Bottom 0.813: R51.2 64.77,93.98 64.77,95.25 CR8.C CR7.A C22.2 U11.14
N$101
  Bottom 0.813: U12.3 R55.1
N$102
  Bottom 0.813: U12.5 68.58,40.64 68.58,45.72 69.85,46.99 76.2,46.99 R56.1
N$103
  Bottom 0.813: U10.11 U10.4
N$104
  Bottom 0.813: U11.11 U11.4
N$105
  Bottom 0.813: U11.7 C21.1
N$106
  Bottom 0.813: C20.1 U11.8
N$107  (via drill 0.81)
  Top 0.813: U22.6 209.55,113.03 209.55,114.3 205.74,118.11 173.99,118.11 154.94,120.65 149.86,121.92 v107.95,121.92
  Bottom 0.813: U12.6 U12.2 U15.6 U15.2 110.49,40.64 110.49,53.34 107.95,57.15 v107.95,121.92 107.95,123.19 R71.2
N$108  (via drill 0.81)
  Top 0.813: U24.3 v214.63,49.53
  Bottom 0.813: v214.63,49.53 214.63,67.31 212.09,72.39 212.09,80.64 214.63,83.82 214.63,125.73 U21.5
N$109  (via drill 0.81)
  Top 0.813: v176.53,99.06 181.61,96.52 196.85,96.52 199.39,95.25 201.93,96.52 201.93,97.79 U22.3
  Bottom 0.813: U19.8 176.53,90.17 v176.53,99.06
N$110
  Bottom 0.813: C24.2 80.01,86.36 R50.1 R49.1
N$111
  Top 0.813: C48.1 R91.2
N$112  (via drill 0.81)
  Top 0.813: R56.2 85.09,59.69 99.69,59.69 112.39,72.39 139.7,72.39 144.78,74.93 v162.56,81.28
  Bottom 0.813: R56.2 R54.1 C24.1 | P1.B1 194.31,176.53 200.66,170.18 200.66,153.67 182.88,140.97 182.88,116.84 161.29,99.06 161.29,88.9 162.56,86.36 v162.56,81.28 165.1,78.74 165.1,46.99 175.26,36.83 CR21.C
N$113
  Top 0.813: U21.2 U21.13
  Bottom 0.813: U23.5 210.82,86.36 210.82,121.92 U21.2 | 3.1 196.85,115.57 196.85,123.19 U21.13
N$114
  Bottom 0.813: R61.2 83.82,147.32 83.82,151.13 C25.2 U13.14 R57.1
N$115
  Bottom 0.813: P3.16 162.56,25.4 157.48,30.48 146.05,30.48 143.51,33.02 143.51,72.39 R72.2 Q2.C R75.1
N$116
  Bottom 0.813: R59.2 C25.1 U13.1 R58.1
N$117
  Bottom 0.813: U13.7 R58.2
N$118
  Bottom 0.813: C27.2 99.06,140.97 R60.2 R59.1
N$119
  Bottom 0.813: R61.1 R62.1 C26.2
N$120
  Bottom 0.813: R63.2 CR10.A CR9.C C28.1 U14.1
N$121
  Bottom 0.813: C29.2 R66.1 R65.1
N$122
  Bottom 0.813: R65.2 83.82,93.98 83.82,95.25 CR10.C CR9.A C28.2 U14.14
N$123
  Bottom 0.813: U15.3 R69.1
N$124
  Bottom 0.813: U15.5 87.63,41.91 87.63,45.72 88.9,46.99 95.25,46.99 R70.1
N$125
  Bottom 0.813: U13.11 U13.4
N$126
  Bottom 0.813: U14.11 U14.4
N$127
  Bottom 0.813: U14.7 C27.1
N$128
  Bottom 0.813: U14.8 C26.1
N$130
  Bottom 0.813: P6.5 259.08,33.02 | 259.08,33.02 P6.6 | 290.63,32.82 290.42,33.02 259.08,33.02 | 290.63,32.82 P7.5 | CR29.2 P7.6 290.83,33.02 290.63,32.82 | C38.1 280.67,73.66 287.02,73.66 | 287.02,73.66 287.02,66.04 R89.1 CR29.2 | CR29.2 CR30.1 | 287.02,73.66 295.91,73.66 | 295.91,73.66 307.34,73.66 308.61,74.93 308.61,78.74 307.34,80.01 303.53,80.01 302.26,81.28 K2.9 | 295.91,73.66 295.91,95.25 293.37,97.79 293.37,124.46 R87.1
N$132
  Bottom 0.813: C30.2 99.06,86.36 R64.1 R63.1
N$133  (via drill 0.81)
  Top 0.813: R69.2 93.98,60.96 99.06,60.96 111.76,73.66 138.43,73.66 v147.32,77.47 v158.75,81.28 | P1.A2 191.77,176.53 v194.31,166.37
  Bottom 0.813: R69.2 R67.1 C29.1 | v147.32,77.47 147.32,55.88 148.59,52.07 148.59,38.1 CR13.C | v194.31,166.37 194.31,154.94 179.07,142.88 179.07,118.75 157.48,100.97 157.48,97.79 157.48,82.55 v158.75,81.28
N$134  (via drill 0.81)
  Top 0.813: R70.2 110.49,74.93 137.16,74.93 v160.02,83.82
  Bottom 0.813: R70.2 R68.1 C30.1 | P1.B2 191.77,176.53 196.85,167.64 196.85,154.94 180.34,142.24 180.34,118.11 158.75,100.33 158.75,85.09 v160.02,83.82 160.02,77.47 163.83,73.66 163.83,46.35 172.72,37.47 CR20.C
N$136
  Top 0.813: U19.5 U23.11
  Bottom 0.813: U23.11 195.58,87.63 195.58,100.33 U22.12
N$137  (via drill 0.81)
  Top 0.813: v191.77,95.25 193.04,93.98 200.66,93.98 U22.1
  Bottom 0.813: U24.8 194.31,67.31 194.31,78.74 191.77,82.55 v191.77,95.25
N$139  (via drill 0.81)
  Top 0.813: v168.91,54.61 U20.10 | CR31.C 220.98,69.85 220.98,86.36 218.44,88.9 209.55,88.9 U23.7 200.66,91.44 9.1
  Bottom 0.813: 9.1 168.91,87.63 v168.91,54.61
N$142
  Top 0.813: CR34.C C33.+
  Bottom 0.813: C33.+ 248.92,167.64 252.73,163.83 U27.1
N$144  (via drill 0.81)
  Top 0.813: v189.23,78.74 U23.13
  Bottom 0.813: U23.13 193.04,85.09 193.04,104.14 U22.10 | U20.1 189.23,49.53 v189.23,78.74
N$146
  Bottom 0.813: P3.22 CR19.A
N$147
  Bottom 0.813: R90.1 274.32,152.4 273.05,158.75 | 273.05,158.75 264.16,157.48 256.54,157.48 252.73,160.02 | 273.05,158.75 271.78,167.64 C53.- 260.35,184.15 243.84,184.15 C52.2 | 252.73,160.02 PAD3.1 | 252.73,160.02 U27.2
N$149
  Bottom 0.813: Q3.C 248.92,140.97 U26.1
N$152
  Bottom 0.813: R81.2 R80.1 Q3.B
N$153
  Bottom 0.813: U19.2 184.15,76.2 184.15,81.28 U19.6
N$155
  Bottom 0.813: Q5.2 241.3,60.96 238.76,66.04 Q4.1
N$156
  Bottom 0.813: Q4.2 R82.2 R83.2
N$157  (via drill 0.81)
  Top 0.813: v270.51,86.36 241.3,38.1 228.6,38.1 C51.- | R90.2 R91.1
  Bottom 0.813: R90.2 269.24,116.84 270.51,107.95 v270.51,86.36
N$158
  Bottom 0.813: R85.1 280.67,62.23 C38.2
N$159
  Top 0.813: U19.12 U19.11
N$161
  Top 0.813: U20.12 171.45,49.53 167.64,53.34 167.64,58.42 175.26,66.04 180.34,66.04 185.42,60.96 U24.9
N$163  (via drill 0.81)
  Top 0.813: U24.6 199.39,64.77 v185.42,64.77
  Bottom 0.813: U20.4 185.42,54.61 v185.42,64.77
N$164  (via drill 0.81)
  Top 0.813: v299.72,116.84 R88.1
  Bottom 0.813: R88.1 CR27.C | K1.5 v299.72,116.84
N$165
  Top 0.813: U20.9 U20.6
N$166
  Bottom 0.813: C49.1 R78.2 R79.1 233.68,81.28 231.14,78.74 U25.4 U25.3
N$173
  Top 0.813: 57.15,17.78 57.15,12.7 55.88,11.43 50.8,11.43 | 50.8,11.43 48.26,13.97 48.26,16.51 50.8,17.78 53.34,15.24 53.34,13.97 50.8,11.43 | 50.8,11.43 46.99,11.43 43.18,12.7 41.91,15.24 41.91,16.51 43.18,17.78 45.72,17.78
N$175
  Bottom 0.813: CR22.A R82.1
N$178  (via drill 0.81)
  Bottom 0.813: P7.4 291.39,29.21 297.18,29.21 | P7.1 296.93,22.86 297.18,22.86 297.18,29.21 | 297.18,29.21 297.18,36.83 CR30.2 306.07,67.31 | 306.07,67.31 v300.99,67.31 | 306.07,67.31 317.5,72.39 317.5,78.74 CR28.A 306.07,83.82 K2.6 304.8,83.82 302.26,87.63 K2.5 302.26,96.52 299.72,99.06 299.72,102.87 302.26,105.41 K1.9 | 306.07,67.31 C39.2
N$179
  Bottom 0.813: R86.1 304.8,113.03 K1.7
N$183
  Top 0.813: U24.2 214.63,46.99 219.71,52.07 CR31.A
N$184
  Bottom 0.813: C36.2 U25.13
N$189
  Bottom 0.813: C36.1 U25.11
N$191
  Bottom 0.813: U25.5 R77.1
N$192  (via drill 0.81)
  Top 0.813: v217.17,63.5 205.74,63.5 203.2,66.04 184.15,66.04 181.61,67.31 163.83,67.31 156.21,60.96 151.13,60.96 148.59,62.23 v123.19,62.23
  Bottom 0.813: U16.1 109.22,116.84 109.22,76.2 v123.19,62.23 | U25.8 213.36,80.01 213.36,73.03 217.17,67.31 v217.17,63.5
N$194
  pour Top: 309.88,120.65 309.88,130.81 325.12,130.81 325.12,120.65
N$196
  Bottom 0.813: P6.2 P6.3
N$197
  Bottom 0.813: P7.2 P7.3
N$198
  Bottom 0.813: 269.24,26.67 269.24,21.59 270.51,20.32 275.59,20.32 | 275.59,20.32 278.13,22.86 278.13,25.4 275.59,26.67 273.05,24.13 273.05,22.86 275.59,20.32 | 275.59,20.32 279.4,20.32 283.21,21.59 284.48,24.13 284.48,25.4 283.21,26.67 280.67,26.67
N$199
  Bottom 0.813: P3.19 170.18,12.7 P3.23
N$201
  Bottom 0.813: P3.24 CR20.A
N$203
  Bottom 0.813: P3.26 CR21.A
N$205
  Bottom 0.813: P3.18 CR17.A
N$207
  Bottom 0.813: P3.20 CR18.A
N$211
  Bottom 0.813: R87.2 337.82,144.78 316.23,123.19 316.23,113.03 307.34,102.87 303.53,102.87 302.26,101.6 K1.8
N$213
  pour Top: 288.29,156.21 288.29,133.35 334.01,133.35 334.01,156.21
  pour Top: 288.29,181.61 288.29,158.75 334.01,158.75 334.01,181.61
N$215
  Bottom 0.813: CT1.+ R88.2
N$222
  Bottom 0.813: CR28.C CR27.A
N$227
  Bottom 0.813: K1.6 303.53,107.95 299.72,107.95 295.91,104.14 295.91,99.06 298.45,96.52 298.45,81.28 K2.8
OD1
  Bottom 0.813: P2.9 130.81,158.75 129.54,160.02 124.46,160.02 121.92,157.48 121.92,151.13 U16.12
OD2
  Bottom 0.813: P2.11 129.54,156.21 U16.6
OD3
  Bottom 0.813: P2.13 130.81,153.67 U16.4
OMARK
  Bottom 0.813: P2.7 123.19,161.29 120.65,158.75 120.65,154.94 U16.10
ONLINE
  Top 0.813: C47.1 176.53,64.77 179.07,64.77 184.15,59.69 184.15,57.15 U20.5 U24.10
  Bottom 0.813: U19.1 184.15,68.58 184.15,57.15 U20.5 | U24.12 198.12,49.53 196.85,50.8 196.85,53.34 198.12,54.61 U24.10 | U20.8 C47.1
OTIMING
  Bottom 0.813: P2.5 123.19,163.83 118.11,158.75 U16.8
PWR(BLUE)
  Top 0.813: U24.4 C44.1
  Bottom 0.813: P4.3 208.91,31.11 208.91,50.16 U24.4 209.55,54.61 209.55,68.58 U23.1
REV  (via drill 0.81)
  Top 0.813: U22.11 186.69,99.06 167.64,111.76 v154.94,114.3 | v172.72,161.29 P2.8
  Bottom 0.813: U23.12 194.31,86.36 194.31,102.87 U22.11 | v154.94,114.3 162.56,120.65 162.56,132.08 163.83,134.62 163.83,151.13 v172.72,161.29 176.53,170.18 P1.B8
REW(ORANGE)  (via drill 0.81)
  Top 0.813: v212.09,55.88 C43.1 | v212.09,68.58 204.47,68.58 U23.15 182.88,68.58 179.07,68.58 U19.13
  Bottom 0.813: P4.5 212.72,30.48 212.72,44.45 v212.09,55.88 v212.09,68.58 | U20.13 171.45,49.53 171.45,52.07 | 171.45,52.07 U20.11 | U19.13 171.45,71.12 171.45,52.07
S0  (via drill 0.81)
  Top 0.813: P2.14 173.99,153.67 180.34,158.75 v180.34,162.56 181.61,171.45 P1.A6 | v163.83,123.19 167.64,123.19 175.26,120.65 200.66,120.65 203.2,123.19 U21.1
  Bottom 0.813: U23.6 209.55,87.63 209.55,120.65 U21.1 | v180.34,162.56 180.34,159.38 168.91,149.22 168.91,128.27 v163.83,123.19
S1  (via drill 0.81)
  Top 0.813: U21.3 209.55,125.73 209.55,121.92 207.01,119.38 173.99,119.38 v166.37,121.92 | P2.16 173.99,151.13 v181.61,157.48
  Bottom 0.813: U21.3 212.09,123.19 212.09,85.09 U23.4 | v166.37,121.92 170.18,125.73 170.18,147.32 v181.61,157.48 P1.B6
SELECTED  (via drill 0.81)
  Top 0.813: 5.1 4.1 | 2.1 1.1 | U23.14 v187.96,76.2 U19.3 U19.4 | U20.2 191.77,46.99 | 191.77,46.99 U24.13 | 191.77,46.99 C37.1
  Bottom 0.813: U20.2 187.96,50.8 v187.96,76.2 186.69,78.74 5.1 191.77,104.14 2.1 U22.9 | 4.1 184.15,113.03 193.04,121.92 193.04,127 U21.10 | 1.1 195.58,119.38 195.58,124.46 U21.12
VCC  (via drill 0.81)
  Top 0.813: U3.8 15.24,26.67 31.75,26.67 | 31.75,26.67 U6.8 | 52.07,26.67 31.75,26.67 | 72.39,26.67 52.07,26.67 | 92.71,26.67 72.39,26.67 | 111.76,26.67 92.71,26.67 | 111.76,26.67 111.76,21.59 U18.14 | 52.07,26.67 U9.8 | 72.39,26.67 U12.8 | 92.71,26.67 U15.8 | v113.03,49.53 v106.68,45.72 111.76,40.64 111.76,26.67 | v106.68,142.24 U16.14 | P2.3 C32.1 v106.68,165.1 97.79,165.1 U13.2 | U14.2 96.52,115.57 v105.41,124.46 107.95,123.19 134.62,123.19 | U25.14 214.63,67.31 203.2,67.31 U23.16 | U21.14 175.26,123.19 167.64,124.46 162.56,124.46 160.02,123.19 140.97,123.19 | 134.62,123.19 140.97,123.19 | 134.62,123.19 C41.+ | 140.97,123.19 C42.1 | P2.4 153.67,166.37 v166.37,179.07 P1.B12
  Bottom 0.813: U1.10 10.16,167.64 10.16,165.1 U1.13 U1.2 27.94,167.64 | U2.10 10.16,120.65 10.16,118.11 U2.13 U2.2 27.94,115.57 | 46.99,115.57 U5.2 U5.13 27.94,115.57 | 46.99,115.57 U8.13 U8.2 64.77,115.57 | 64.77,115.57 U11.13 U11.2 83.82,115.57 | 83.82,115.57 U14.13 U14.2 | U5.10 27.94,120.65 27.94,115.57 | 27.94,167.64 U4.10 | 27.94,167.64 27.94,166.37 U4.13 U4.2 46.99,167.64 | U8.10 46.99,120.65 46.99,115.57 | U11.10 64.77,120.65 64.77,115.57 | U14.10 83.82,120.65 83.82,115.57 | U13.2 U13.13 83.82,166.37 83.82,167.64 | 46.99,167.64 U7.10 | 64.77,166.37 U7.2 U7.13 46.99,166.37 46.99,167.64 | 64.77,166.37 U10.10 | 83.82,167.64 U13.10 | 83.82,167.64 U10.2 U10.13 64.77,166.37 | U17.16 113.03,45.72 v113.03,49.53 | v106.68,165.1 v106.68,142.24 R71.1 106.68,127 v105.41,124.46 | P2.3 P2.4 | 222.25,83.82 U25.9 | 222.25,83.82 222.25,87.63 C35.1 | 222.25,71.12 222.25,83.82 | 227.33,64.77 CR22.C | 227.33,64.77 229.87,67.31 R77.2 | 222.25,71.12 227.33,64.77 | U25.14 222.25,71.12 | 176.53,44.45 U20.14 | 176.53,44.45 176.53,68.58 U19.14 | 176.53,44.45 176.53,40.64 182.88,33.02 199.39,33.02 201.93,35.56 201.93,44.45 | 201.93,44.45 U24.14 | U21.14 201.93,120.65 201.93,97.79 | 201.93,97.79 U22.14 | 201.93,97.79 201.93,71.12 | 201.93,71.12 U23.16 | 201.93,71.12 201.93,44.45 | v166.37,179.07 P1.B12
  Bottom 1.016: v105.41,124.46 105.41,55.88 107.95,52.07 107.95,46.99 v106.68,45.72
WE(YELLOW)
  Top 0.813: C45.1 U24.1
  Bottom 0.813: P4.2 207.01,30.48 U24.1 | C45.1 210.82,69.85 U23.2

## Text on the board
Top: + | -5V | + | +5V | +15V | + | + | + | + | + | Computer Operations, Inc.
Bottom: Computer Operations, Inc.
tPlace: Check Mounting Holes